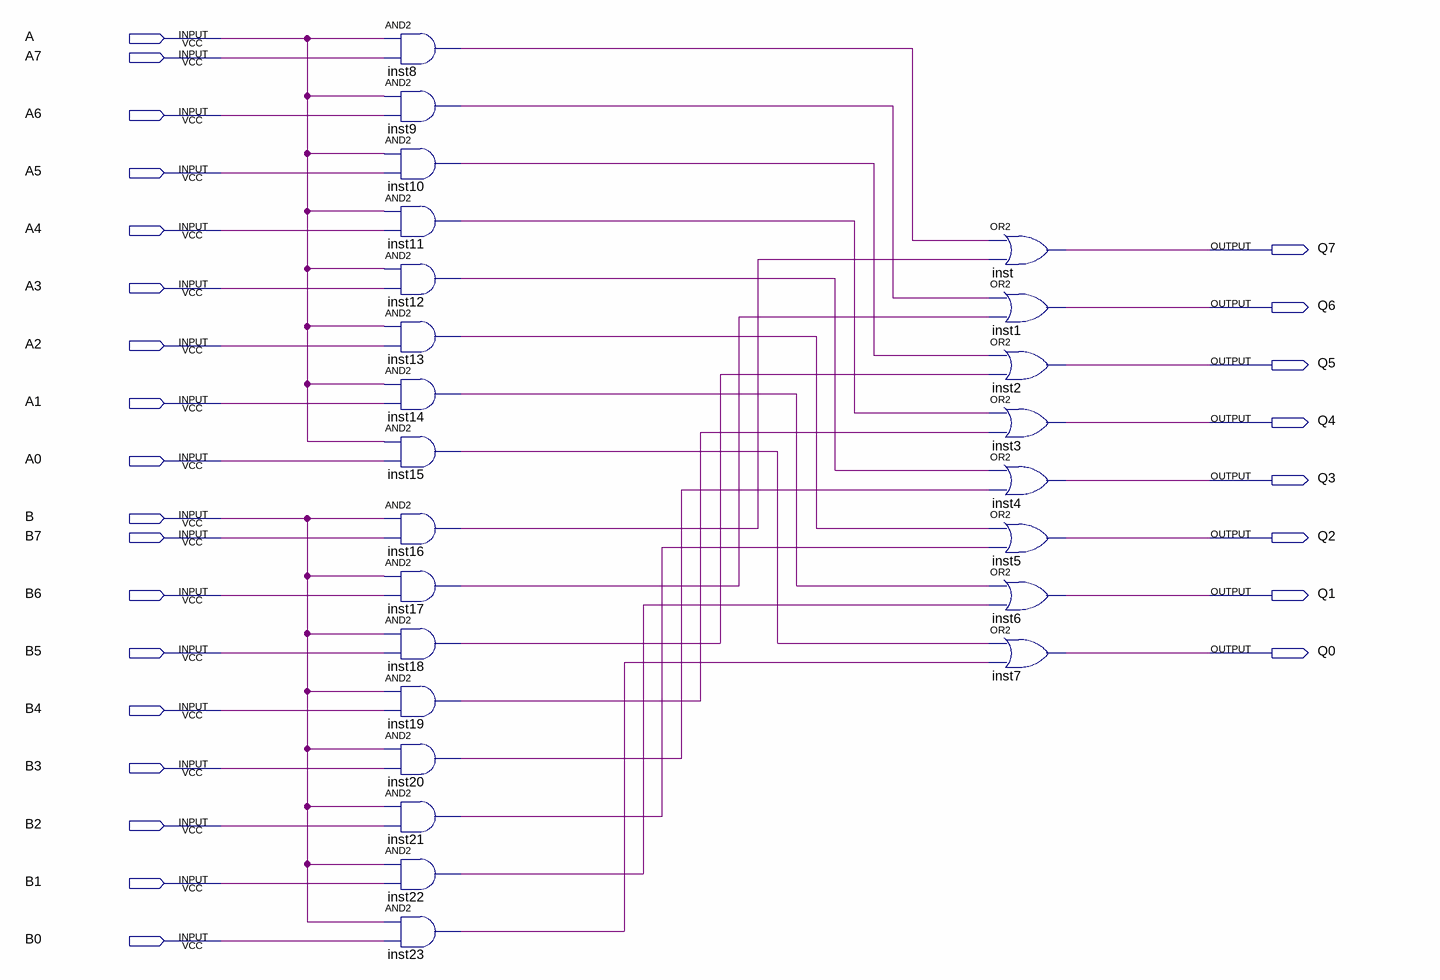
[diagram p0: schematic sheet]
// Quartus schematic 21SEL.bdf as structural Verilog: 24 symbols, 26 pins
module \21SEL  (
  input  A,
  input  A7,
  input  A6,
  input  A5,
  input  A4,
  input  A3,
  input  A2,
  input  A1,
  input  A0,
  input  B,
  input  B7,
  input  B6,
  input  B5,
  input  B4,
  input  B3,
  input  B2,
  input  B1,
  input  B0,
  output Q7,
  output Q6,
  output Q5,
  output Q4,
  output Q3,
  output Q2,
  output Q1,
  output Q0
);

  wire inst8_out, inst9_out, inst10_out, inst11_out, inst12_out, inst13_out, inst14_out, inst15_out,
       inst16_out, inst17_out, inst18_out, inst19_out, inst20_out, inst21_out, inst22_out, inst23_out;

  and inst8 (inst8_out, A, A7);
  and inst9 (inst9_out, A, A6);
  and inst10 (inst10_out, A, A5);
  and inst11 (inst11_out, A, A4);
  and inst12 (inst12_out, A, A3);
  and inst13 (inst13_out, A, A2);
  and inst14 (inst14_out, A, A1);
  and inst15 (inst15_out, A, A0);
  and inst16 (inst16_out, B, B7);
  and inst17 (inst17_out, B, B6);
  and inst18 (inst18_out, B, B5);
  and inst19 (inst19_out, B, B4);
  and inst20 (inst20_out, B, B3);
  and inst21 (inst21_out, B, B2);
  and inst22 (inst22_out, B, B1);
  and inst23 (inst23_out, B, B0);
  or inst (Q7, inst8_out, inst16_out);
  or inst1 (Q6, inst9_out, inst17_out);
  or inst2 (Q5, inst10_out, inst18_out);
  or inst3 (Q4, inst11_out, inst19_out);
  or inst4 (Q3, inst12_out, inst20_out);
  or inst5 (Q2, inst13_out, inst21_out);
  or inst6 (Q1, inst14_out, inst22_out);
  or inst7 (Q0, inst15_out, inst23_out);
endmodule
